# EAGLE board SP-PC-V3.0 (EAGLE 8.7.0), part 1 of 2
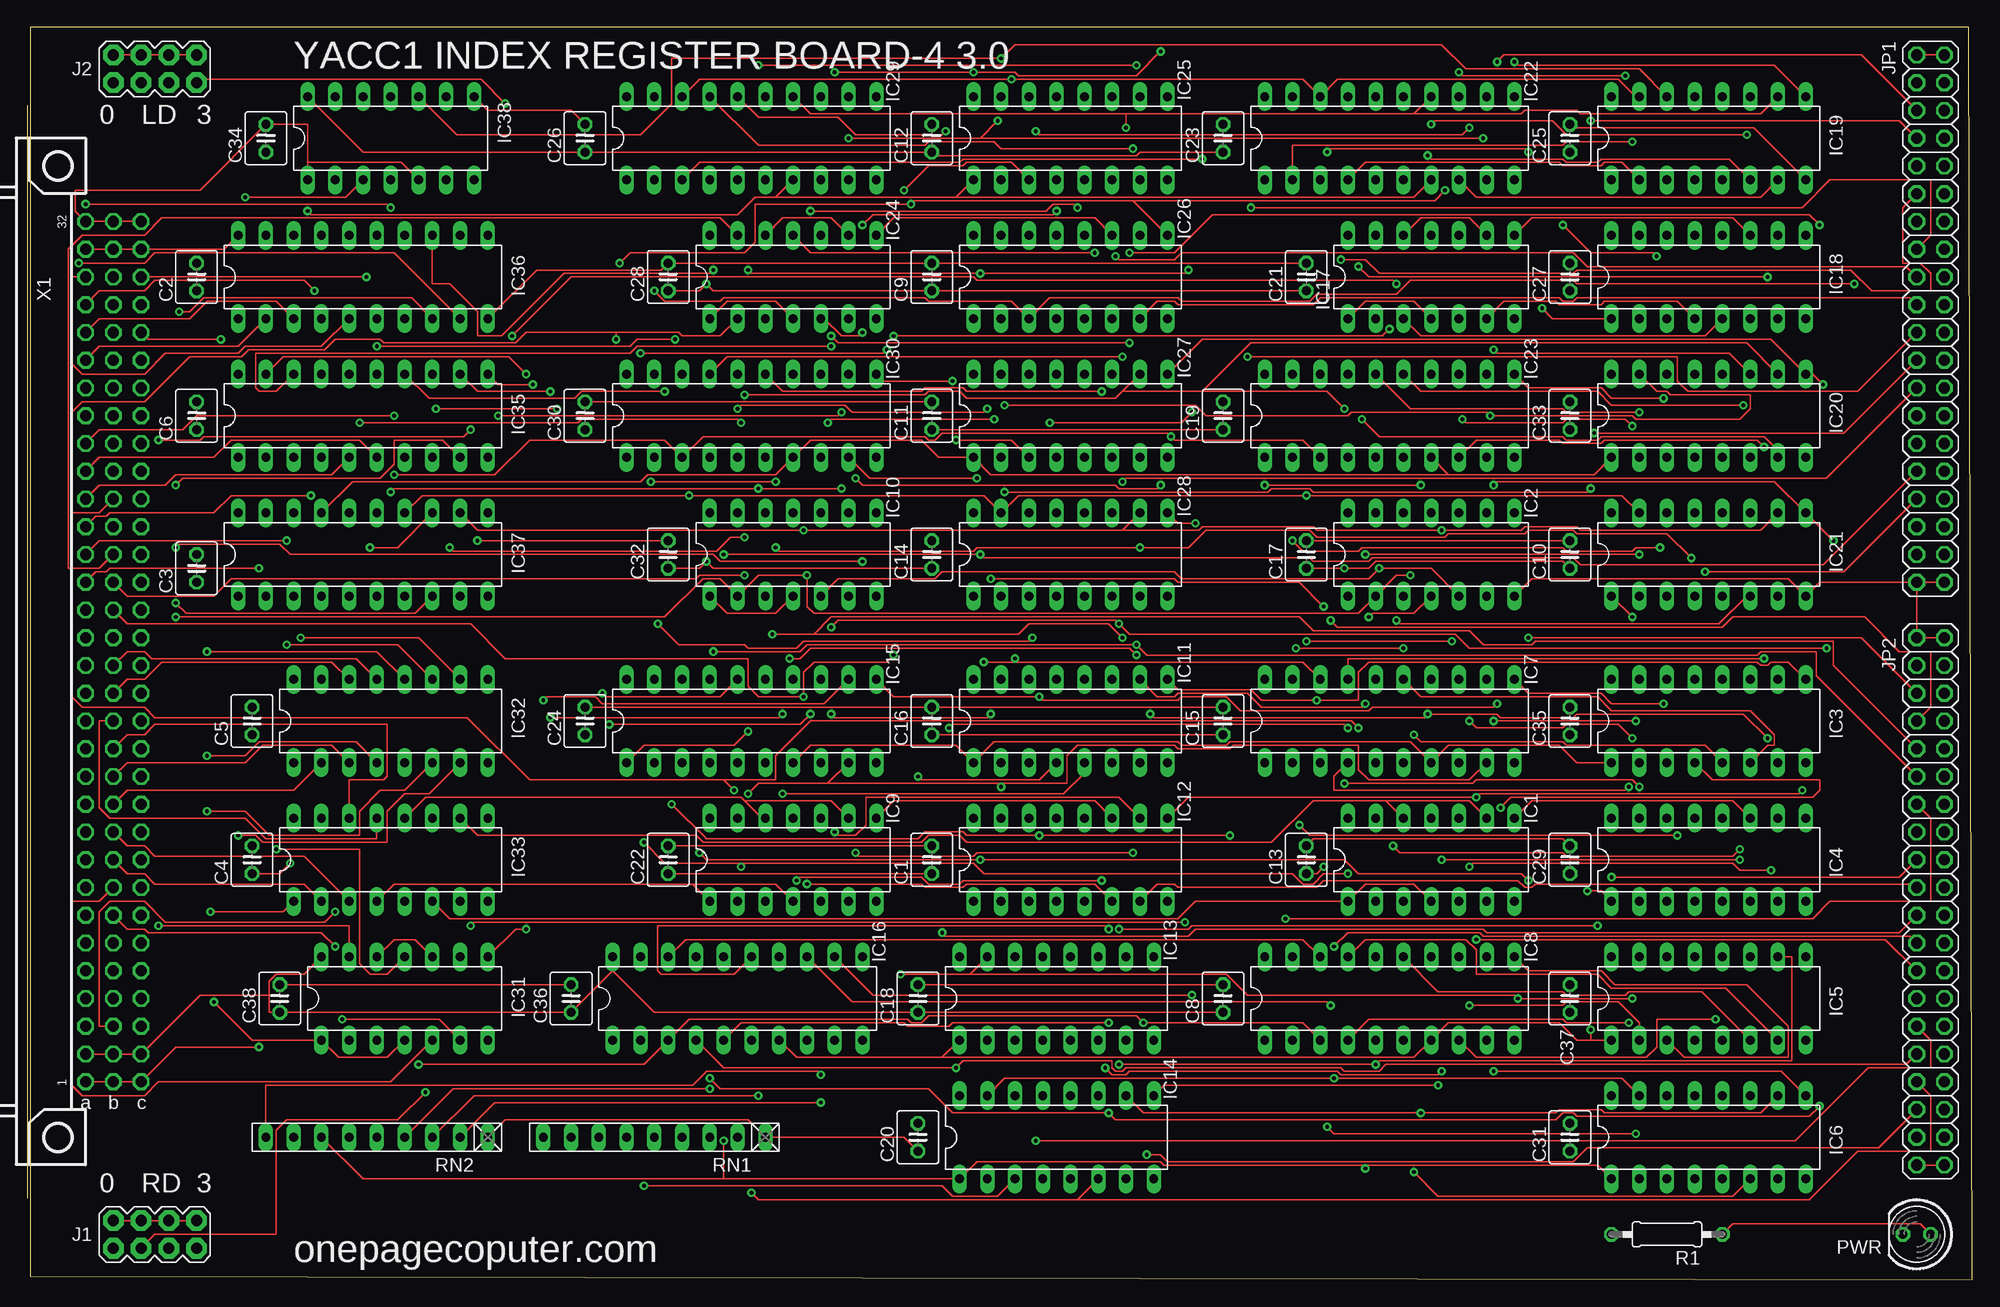
[diagram p9: board, top side]
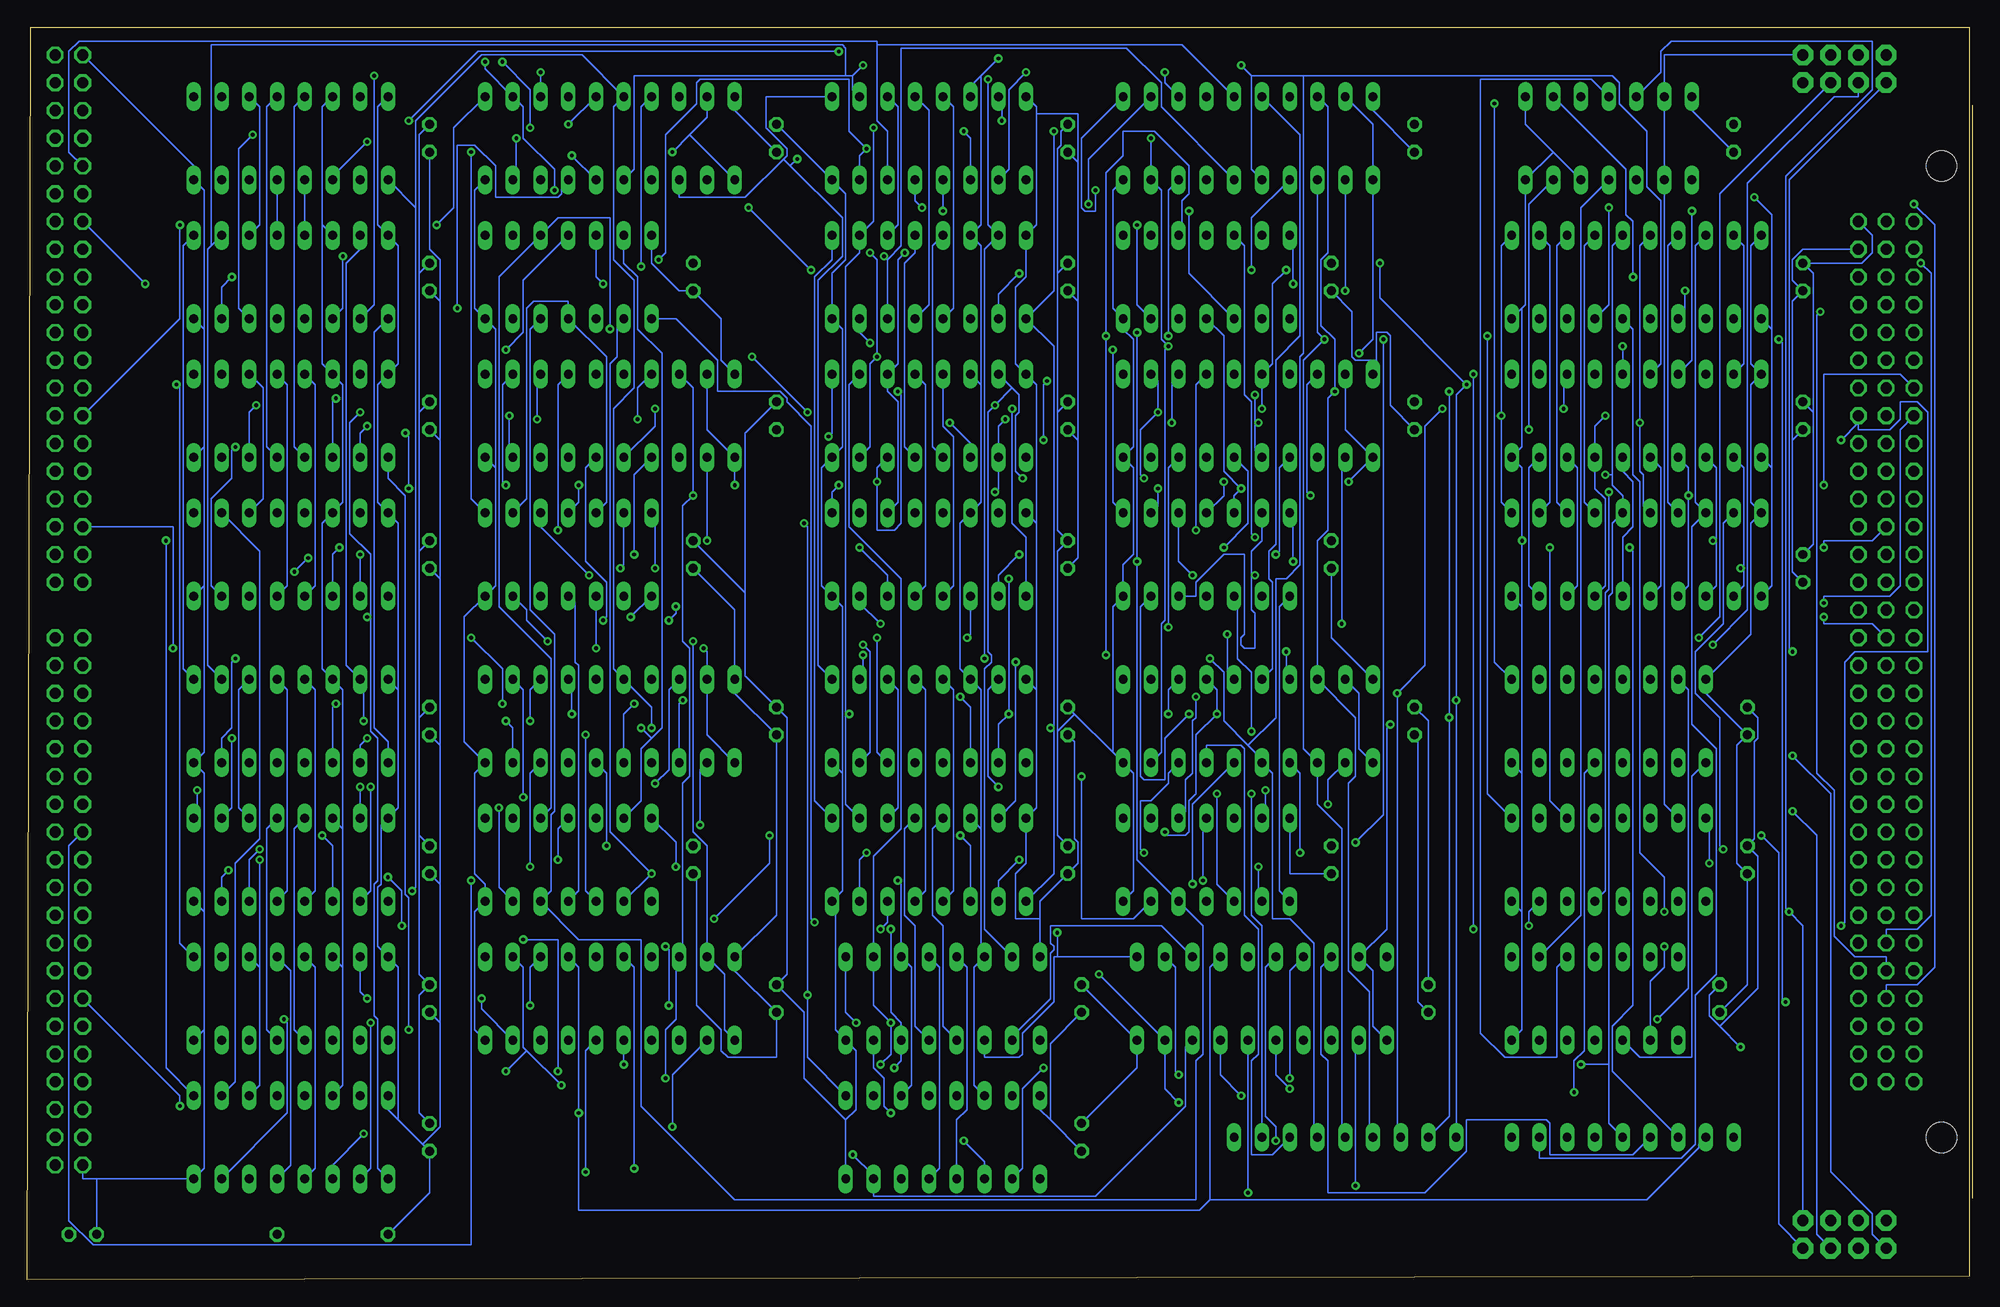
[diagram p10: board, bottom side, seen from below]

Size 177.8 x 114.62 mm. Coordinates in mm from the lower left corner, seen from the top.
Outline: 0,0.33 177.8,0 177.47,114.62 0,114.62 0,0.33
Copper layers (1*16): Top 0.035mm / dielectric 1.5mm / Bottom 0.035mm
Design rules "default": minimum track width 6mil, minimum drill 0.35mm, track to track 6mil, track to pad 6mil, pad to pad 6mil, via to via 6mil, smd to smd 6mil, copper to edge 40mil, drill to drill 6mil, minimum pad ring 10mil, minimum via ring 8mil, stop-mask expansion 4mil, vias tented up to drill 0mil, thermal gap 10mil

## Footprints (pad centres in the part's own frame; a part is rotated, then mirrored left to right if it is on the bottom)
C025-040X050 = drill 0.813 octagon: 1 -1.27,0; 2 1.27,0
DIL14 = drill 0.813 long: 1 -7.62,-3.81; 2 -5.08,-3.81; 3 -2.54,-3.81; 4 0,-3.81; 5 2.54,-3.81; 6 5.08,-3.81; 7 7.62,-3.81; 8 7.62,3.81; 9 5.08,3.81; 10 2.54,3.81; 11 0,3.81; 12 -2.54,3.81; 13 -5.08,3.81; 14 -7.62,3.81
DIL16 = drill 0.813 long: 1 -8.89,-3.81; 2 -6.35,-3.81; 3 -3.81,-3.81; 4 -1.27,-3.81; 5 1.27,-3.81; 6 3.81,-3.81; 7 6.35,-3.81; 8 8.89,-3.81; 9 8.89,3.81; 10 6.35,3.81; 11 3.81,3.81; 12 1.27,3.81; 13 -1.27,3.81; 14 -3.81,3.81; 15 -6.35,3.81; 16 -8.89,3.81
DIL20 = drill 0.813 long: 1 -11.43,-3.81; 2 -8.89,-3.81; 3 -6.35,-3.81; 4 -3.81,-3.81; 5 -1.27,-3.81; 6 1.27,-3.81; 7 3.81,-3.81; 8 6.35,-3.81; 9 8.89,-3.81; 10 11.43,-3.81; 11 11.43,3.81; 12 8.89,3.81; 13 6.35,3.81; 14 3.81,3.81; 15 1.27,3.81; 16 -1.27,3.81; 17 -3.81,3.81; 18 -6.35,3.81; 19 -8.89,3.81; 20 -11.43,3.81
2X4 = drill 1.016 pad 1.88 octagon: 1 -3.81,-1.27; 2 -3.81,1.27; 3 -1.27,-1.27; 4 -1.27,1.27; 5 1.27,-1.27; 6 1.27,1.27; 7 3.81,-1.27; 8 3.81,1.27
2X20 = drill 1.016 octagon: 1 -24.13,-1.27; 2 -24.13,1.27; 3 -21.59,-1.27; 4 -21.59,1.27; 5 -19.05,-1.27; 6 -19.05,1.27; 7 -16.51,-1.27; 8 -16.51,1.27; 9 -13.97,-1.27; 10 -13.97,1.27; 11 -11.43,-1.27; 12 -11.43,1.27; 13 -8.89,-1.27; 14 -8.89,1.27; 15 -6.35,-1.27; 16 -6.35,1.27; 17 -3.81,-1.27; 18 -3.81,1.27; 19 -1.27,-1.27; 20 -1.27,1.27; 21 1.27,-1.27; 22 1.27,1.27; 23 3.81,-1.27; 24 3.81,1.27; 25 6.35,-1.27; 26 6.35,1.27; 27 8.89,-1.27; 28 8.89,1.27; 29 11.43,-1.27; 30 11.43,1.27; 31 13.97,-1.27; 32 13.97,1.27; 33 16.51,-1.27; 34 16.51,1.27; 35 19.05,-1.27; 36 19.05,1.27; 37 21.59,-1.27; 38 21.59,1.27; 39 24.13,-1.27; 40 24.13,1.27
LED5MM = drill 0.813 octagon: A -1.27,0; K 1.27,0
0207/10 = drill 0.813 octagon: 1 -5.08,0; 2 5.08,0
RN-9 = drill 0.813 long: 1 -10.16,0; 2 -7.62,0; 3 -5.08,0; 4 -2.54,0; 5 0,0; 6 2.54,0; 7 5.08,0; 8 7.62,0; 9 10.16,0
FABC96R = drill 1.016 octagon: A1 -2.54,39.37; A2 -2.54,36.83; A3 -2.54,34.29; A4 -2.54,31.75; A5 -2.54,29.21; A6 -2.54,26.67; A7 -2.54,24.13; A8 -2.54,21.59; A9 -2.54,19.05; A10 -2.54,16.51; A11 -2.54,13.97; A12 -2.54,11.43; A13 -2.54,8.89; A14 -2.54,6.35; A15 -2.54,3.81; A16 -2.54,1.27; A17 -2.54,-1.27; A18 -2.54,-3.81; A19 -2.54,-6.35; A20 -2.54,-8.89; A21 -2.54,-11.43; A22 -2.54,-13.97; A23 -2.54,-16.51; A24 -2.54,-19.05; A25 -2.54,-21.59; A26 -2.54,-24.13; A27 -2.54,-26.67; A28 -2.54,-29.21; A29 -2.54,-31.75; A30 -2.54,-34.29; A31 -2.54,-36.83; A32 -2.54,-39.37; B1 -5.08,39.37; B2 -5.08,36.83; B3 -5.08,34.29; B4 -5.08,31.75; B5 -5.08,29.21; B6 -5.08,26.67; B7 -5.08,24.13; B8 -5.08,21.59; B9 -5.08,19.05; B10 -5.08,16.51; B11 -5.08,13.97; B12 -5.08,11.43; B13 -5.08,8.89; B14 -5.08,6.35; B15 -5.08,3.81; B16 -5.08,1.27; B17 -5.08,-1.27; B18 -5.08,-3.81; B19 -5.08,-6.35; B20 -5.08,-8.89; B21 -5.08,-11.43; B22 -5.08,-13.97; B23 -5.08,-16.51; B24 -5.08,-19.05; B25 -5.08,-21.59; B26 -5.08,-24.13; B27 -5.08,-26.67; B28 -5.08,-29.21; B29 -5.08,-31.75; B30 -5.08,-34.29; B31 -5.08,-36.83; B32 -5.08,-39.37; C1 -7.62,39.37; C2 -7.62,36.83; C3 -7.62,34.29; C4 -7.62,31.75; C5 -7.62,29.21; C6 -7.62,26.67; C7 -7.62,24.13; C8 -7.62,21.59; C9 -7.62,19.05; C10 -7.62,16.51; C11 -7.62,13.97; C12 -7.62,11.43; C13 -7.62,8.89; C14 -7.62,6.35; C15 -7.62,3.81; C16 -7.62,1.27; C17 -7.62,-1.27; C18 -7.62,-3.81; C19 -7.62,-6.35; C20 -7.62,-8.89; C21 -7.62,-11.43; C22 -7.62,-13.97; C23 -7.62,-16.51; C24 -7.62,-19.05; C25 -7.62,-21.59; C26 -7.62,-24.13; C27 -7.62,-26.67; C28 -7.62,-29.21; C29 -7.62,-31.75; C30 -7.62,-34.29; C31 -7.62,-36.83; C32 -7.62,-39.37 | hole 2.794: 0,-44.456; 0,44.456

## Placement (x,y rotation side)
C1  0.1  [C025-040X050]  82.55,38.43 90 top
C2  0.1  [C025-040X050]  15.24,91.77 90 top
C3  0.1  [C025-040X050]  15.24,65.1 90 top
C4  0.1  [C025-040X050]  20.32,38.43 90 top
C5  0.1  [C025-040X050]  20.32,51.13 90 top
C6  0.1  [C025-040X050]  15.24,79.07 90 top
C8  0.1  [C025-040X050]  109.22,25.73 90 top
C9  0.1  [C025-040X050]  82.55,91.77 90 top
C10  0.1  [C025-040X050]  140.97,66.37 90 top
C11  0.1  [C025-040X050]  82.55,79.07 90 top
C12  0.1  [C025-040X050]  82.55,104.47 90 top
C13  0.1  [C025-040X050]  116.84,38.43 90 top
C14  0.1  [C025-040X050]  82.55,66.37 90 top
C15  0.1  [C025-040X050]  109.22,51.13 90 top
C16  0.1  [C025-040X050]  82.55,51.13 90 top
C17  0.1  [C025-040X050]  116.84,66.37 90 top
C18  0.1  [C025-040X050]  81.28,25.73 90 top
C19  0.1  [C025-040X050]  109.22,79.07 90 top
C20  0.1  [C025-040X050]  81.28,13.03 90 top
C21  0.1  [C025-040X050]  116.84,91.77 90 top
C22  0.1  [C025-040X050]  58.42,38.43 90 top
C23  0.1  [C025-040X050]  109.22,104.47 90 top
C24  0.1  [C025-040X050]  50.8,51.13 90 top
C25  0.1  [C025-040X050]  140.97,104.47 90 top
C26  0.1  [C025-040X050]  50.8,104.47 90 top
C27  0.1  [C025-040X050]  140.97,91.77 90 top
C28  0.1  [C025-040X050]  58.42,91.77 90 top
C29  0.1  [C025-040X050]  140.97,38.43 90 top
C30  0.1  [C025-040X050]  50.8,79.07 90 top
C31  0.1  [C025-040X050]  140.97,13.03 90 top
C32  0.1  [C025-040X050]  58.42,66.37 90 top
C33  0.1  [C025-040X050]  140.97,79.07 90 top
C34  0.1  [C025-040X050]  21.59,104.47 90 top
C35  0.1  [C025-040X050]  140.97,51.13 90 top
C36  0.1  [C025-040X050]  49.53,25.73 90 top
C37  0.1  [C025-040X050]  140.97,25.73 90 top
C38  0.1  [C025-040X050]  22.86,25.73 90 top
IC1  74LS32N  [DIL14]  128.27,38.43 0 top
IC2  74LS32N  [DIL14]  128.27,66.37 0 top
IC3  74LS192N  [DIL16]  153.67,51.13 0 top
IC4  74LS192N  [DIL16]  153.67,38.43 0 top
IC5  74LS192N  [DIL16]  153.67,25.73 0 top
IC6  74LS192N  [DIL16]  153.67,13.03 0 top
IC7  74LS244N  [DIL20]  124.46,51.13 0 top
IC8  74LS244N  [DIL20]  124.46,25.73 0 top
IC9  74LS32N  [DIL14]  69.85,38.43 0 top
IC10  74LS32N  [DIL14]  69.85,66.37 0 top
IC11  74LS192N  [DIL16]  95.25,51.13 0 top
IC12  74LS192N  [DIL16]  95.25,38.43 0 top
IC13  74LS192N  [DIL16]  93.98,25.73 0 top
IC14  74LS192N  [DIL16]  93.98,13.03 0 top
IC15  74LS244N  [DIL20]  66.04,51.13 0 top
IC16  74LS244N  [DIL20]  64.77,25.73 0 top
IC17  74LS32N  [DIL14]  128.27,91.77 0 top
IC18  74LS192N  [DIL16]  153.67,91.77 0 top
IC19  74LS192N  [DIL16]  153.67,104.47 0 top
IC20  74LS192N  [DIL16]  153.67,79.07 0 top
IC21  74LS192N  [DIL16]  153.67,66.37 0 top
IC22  74LS244N  [DIL20]  124.46,104.47 0 top
IC23  74LS244N  [DIL20]  124.46,79.07 0 top
IC24  74LS32N  [DIL14]  69.85,91.77 0 top
IC25  74LS192N  [DIL16]  95.25,104.47 0 top
IC26  74LS192N  [DIL16]  95.25,91.77 0 top
IC27  74LS192N  [DIL16]  95.25,79.07 0 top
IC28  74LS192N  [DIL16]  95.25,66.37 0 top
IC29  74LS244N  [DIL20]  66.04,104.47 0 top
IC30  74LS244N  [DIL20]  66.04,79.07 0 top
IC31  74LS32N  [DIL14]  34.29,25.73 0 top
IC32  74LS139N  [DIL16]  33.02,51.13 0 top
IC33  74LS139N  [DIL16]  33.02,38.43 0 top
IC35  74LS245N  [DIL20]  30.48,79.07 0 top
IC36  74LS245N  [DIL20]  30.48,91.77 0 top
IC37  74LS245N  [DIL20]  30.48,66.37 0 top
IC38  74LS266N  [DIL14]  33.02,104.47 0 top
J1  [2X4]  11.43,4.14 0 top
J2  [2X4]  11.43,110.82 0 top
JP1  [2X20]  173.99,87.96 270 top
JP2  [2X20]  173.99,34.62 270 top
PWR  [LED5MM]  172.72,4.14 180 top
R1  330  [0207/10]  149.86,4.14 180 top
RN1  10k  [RN-9]  57.15,13.03 180 top
RN2  10k  [RN-9]  31.75,13.03 180 top
X1  FABC96R  [FABC96R]  2.54,57.48 180 top

## Tracks (layer width: path | path; a pad name or v marks a point on that pad's centre or on a via)
-BUS-EN  (via drill 0.35)
  Top 0.152: IC31.4 32.7,20.33 28.26,20.33 IC31.1 20.32,21.92 v16.83,25.41 | X1.C28 10.79,86.05 v17.46,86.05
  Bottom 0.152: v17.46,86.05 17.14,85.74 17.14,25.73 v16.83,25.41
-HL-SWAP  (via drill 0.35)
  Top 0.152: IC31.13 29.21,32.4 v11.75,32.4 | v40.32,77.8 39.69,77.16 15.88,77.16 15.56,76.85 v11.75,76.85
  Bottom 0.152: v11.75,32.4 11.43,32.71 11.43,56.53 10.48,57.48 3.81,57.48 3.81,79.39 4.76,80.34 6.35,80.34 6.35,78.75 7.3,77.8 10.16,77.8 10.16,78.44 | IC38.6 40.32,98.44 v40.32,77.8 | 10.16,78.44 v11.75,76.85 | 10.16,78.44 X1.C25
-LDSEL
  Top 0.152: J2.2 J2.4 J2.6 J2.8
  Bottom 0.152: IC33.15 27.94,43.51 IC38.2 IC38.13 27.94,112.09 J2.8
-R0-LDSEL
  Top 0.152: IC33.12 36.2,44.14 65.09,44.14 65.41,43.83 | 65.41,43.83 66.99,42.24 IC9.12 | IC9.9 73.34,43.83 65.41,43.83
-R0-RDSEL
  Top 0.152: IC10.1 63.82,60.97 68.26,60.97 IC10.4 | IC33.4 33.34,36.21 60.64,36.21 | IC9.1 60.64,36.21 | IC9.4 68.26,36.21 60.64,36.21
  Bottom 0.152: IC10.1 63.18,61.61 63.18,35.57 IC9.1
-R1-LDSEL  (via drill 0.35)
  Top 0.152: v38.42,67 38.73,66.69 62.87,66.69 64.14,67.96 v65.41,67.96 | IC24.9 73.34,97.17 68.9,97.17 IC24.12
  Bottom 0.152: IC33.11 38.42,43.83 v38.42,67 | v65.41,67.96 65.72,68.27 65.72,80.34 66.36,80.97 66.36,94.63 IC24.12
-R1-RDSEL  (via drill 0.35)
  Top 0.152: IC24.1 63.82,89.55 68.26,89.55 IC24.4 | v33.02,72.08 33.34,72.4 v66.67,72.4 v74.3,72.4
  Bottom 0.152: IC33.5 33.34,35.57 33.34,62.88 33.02,63.2 v33.02,72.08 | IC10.12 67.31,71.77 v66.67,72.4 68.26,73.99 68.26,86.37 IC24.4 | IC10.9 74.3,70.81 v74.3,72.4
-R2-LDSEL
  Top 0.152: IC33.10 40.96,40.65 60.96,40.65 61.59,40.02 81.6,40.02 82.23,40.65 85.09,40.65 85.72,40.02 113.67,40.02 117.47,43.83 124.14,43.83 | IC1.12 124.14,43.83 | IC1.9 131.76,43.83 124.14,43.83
-R2-RDSEL  (via drill 0.35)
  Top 0.152: v122.56,60.66 122.87,60.97 126.68,60.97 IC2.4 | IC33.6 38.42,33.03 105.09,33.03 106.68,34.62 IC1.1 122.24,36.21 126.68,36.21 IC1.4
  Bottom 0.152: v122.56,60.66 IC2.1 | IC2.4 127.64,61.92 127.64,56.53 127.32,56.21 127.32,35.57 IC1.4
-R3-LDSEL  (via drill 0.35)
  Top 0.152: v44.13,86.37 49.53,91.77 86.36,91.77 86.68,91.45 124.78,91.45 v125.09,91.14 | IC17.9 131.76,97.17 127.32,97.17 IC17.12
  Bottom 0.152: IC33.9 44.13,44.46 v44.13,86.37 | v125.09,91.14 125.73,91.77 IC17.12
-R3-RDSEL  (via drill 0.35)
  Top 0.152: v40.32,32.4 40.64,32.71 v105.73,32.71 | IC17.4 126.68,89.55 122.24,89.55 IC17.1
  Bottom 0.152: IC2.12 124.78,71.13 124.78,84.47 IC17.4 128.27,89.55 131.44,89.55 132.08,88.91 132.08,71.45 IC2.9 | IC33.7 40.32,33.67 v40.32,32.4 | v105.73,32.71 106.05,33.03 106.05,78.12 108.27,80.34 108.27,80.66 108.9,81.29 114.62,81.29 114.62,84.15 118.43,87.96 IC17.1
-RDSEL  (via drill 0.35)
  Top 0.152: J1.2 J1.4 J1.6 J1.8 | IC33.1 23.18,33.67 v16.51,33.67
  Bottom 0.152: J1.8 15.24,32.4 v16.51,33.67 16.83,33.98 16.83,100.98 8.89,108.91 8.89,113.36 27.3,113.36 28.26,112.41 28.26,110.5 IC38.12
-REG-DN  (via drill 0.35)
  Top 0.152: v76.2,86.69 75.88,86.37 74.3,86.37 72.71,87.96 IC24.5 | v13.34,67 13.65,67.32 22.86,67.32 23.81,66.37 62.55,66.37 63.18,65.73 v76.2,65.73
  Bottom 0.152: IC17.5 131.76,87.01 131.76,61.29 129.54,59.07 129.54,42.88 129.86,42.56 129.86,35.57 IC1.5 127.32,31.13 121.6,31.13 121.6,15.89 113.03,7.32 70.8,7.32 70.8,20.01 70.17,20.65 70.17,32.4 IC9.5 76.2,38.43 v76.2,65.73 v76.2,86.69 | X1.B21 8.89,67.64 13.34,67.64 v13.34,67
-REG-FUNC-LD
  Top 0.152: IC31.5 33.02,18.11 11.75,18.11 10.48,16.84 4.76,16.84 3.81,17.79 3.81,34.62 6.35,34.62 X1.B8
-REG-FUNC-RD  (via drill 0.35)
  Top 0.152: v27.94,30.49 26.67,31.76 10.79,31.76 10.48,32.08 8.89,32.08 X1.B7
  Bottom 0.152: IC31.2 29.21,27.32 27.94,28.59 v27.94,30.49
-REG-LD-HI  (via drill 0.35)
  Top 0.152: 63.5,45.73 v64.45,44.78 | 63.5,45.73 45.72,45.73 40.01,51.45 11.43,51.45 10.48,52.4 4.76,52.4 3.81,53.35 3.81,65.1 | 3.81,65.1 6.35,65.1 X1.B20 | IC24.13 63.18,97.17 12.06,97.17 10.48,95.58 4.76,95.58 3.49,94.31 3.49,65.1 3.81,65.1 | v121.6,50.49 120.97,51.13 71.44,51.13 68.26,47.95 68.26,45.73 63.5,45.73
  Bottom 0.152: IC1.13 121.6,43.83 121.6,48.59 120.65,49.54 | 120.65,49.54 119.7,50.49 119.7,84.78 121.92,87.01 121.92,91.77 123.19,93.04 IC17.13 | IC9.13 64.45,42.56 v64.45,44.78 | v121.6,50.49 120.65,49.54
-REG-LD-LO  (via drill 0.35)
  Top 0.152: X1.B18 8.89,60.02 40.32,60.02 43.5,56.84 65.72,56.84 65.72,54.3 66.67,53.35 v70.8,53.35 70.8,55.57 71.75,56.53 78.42,56.53 v79.06,57.16 | v124.46,87.01 123.83,86.37 v79.06,86.37
  Bottom 0.152: IC1.10 129.86,43.19 129.86,56.84 134.62,61.61 134.62,91.77 IC17.10 129.22,97.17 124.46,97.17 v124.46,87.01 | IC9.10 71.75,42.88 71.75,45.73 71.12,46.37 71.12,51.13 70.8,51.45 v70.8,53.35 | IC24.10 72.07,95.9 72.07,98.75 71.44,99.39 71.44,101.93 74.61,105.11 77.47,105.11 77.47,102.88 79.06,101.3 v79.06,86.37 v79.06,57.16
-REG-RD-HI  (via drill 0.35)
  Top 0.152: IC2.5 128.27,65.1 v123.51,65.1 122.56,64.15 105.41,64.15 104.78,64.78 83.5,64.78 82.87,64.15 73.98,64.15 IC10.5 | X1.B19 8.89,62.56 16.83,62.56 18.41,64.15 60.96,64.15 61.28,64.47 v65.41,64.47
  Bottom 0.152: v123.51,65.1 123.19,65.42 IC2.13 | IC10.5 70.8,62.56 70.8,63.83 68.26,66.37 66.36,66.37 66.36,59.07 66.67,58.75 66.67,58.11 66.36,57.8 65.41,57.8 65.41,60.97 65.72,61.29 65.72,64.47 | 65.72,64.47 65.72,66.69 64.77,67.64 IC10.13 | 65.72,64.47 v65.41,64.47
-REG-RD-LO  (via drill 0.35)
  Top 0.152: v126.36,64.47 125.09,64.47 IC2.2 121.6,60.97 71.75,60.97 71.12,61.61 v71.12,64.47 66.67,64.47 IC10.2 63.18,64.15 61.59,64.15 58.1,60.66 v13.34,60.66
  Bottom 0.152: v126.36,64.47 130.81,68.91 IC2.10 | v71.12,64.47 72.39,65.73 IC10.10 | X1.B17 8.89,60.02 13.34,60.02 v13.34,60.66
-REG-UP  (via drill 0.35)
  Top 0.152: IC24.2 63.18,86.37 59.69,86.37 59.37,86.69 53.66,86.69 | 53.66,86.69 45.4,86.69 44.45,85.74 32.38,85.74 32.07,86.05 27.94,86.05 26.99,85.1 20,85.1 19.37,84.47 14.61,84.47 10.48,80.34 4.76,80.34 3.81,79.39 3.81,70.18 6.35,70.18 X1.B22 | 65.41,38.11 v65.09,37.8 | 65.41,38.11 86.36,38.11 87.31,37.16 115.57,37.16 116.52,36.21 117.47,36.21 118.43,37.16 v120.65,37.16 | v53.66,86.05 53.66,86.69 | v56.2,40.02 58.1,38.11 65.41,38.11
  Bottom 0.152: IC9.2 65.09,34.94 v65.09,37.8 | IC1.2 v120.65,37.16 124.46,40.97 124.46,83.83 123.83,84.47 123.83,87.33 IC17.2 | v53.66,86.05 53.66,42.56 v56.2,40.02
-RESET  (via drill 0.35)
  Top 0.152: X1.C30 v30.8,91.77
  Bottom 0.152: IC38.9 31.43,101.61 31.43,97.48 30.8,96.85 v30.8,91.77
-RLD0  (via drill 0.35)
  Top 0.152: IC32.12 31.75,57.48 v16.19,57.48
  Bottom 0.152: v16.19,57.48 16.51,57.8 16.51,100.66 J2.1
-RRD0  (via drill 0.35)
  Top 0.152: IC32.4 29.84,49.23 20.95,49.23 19.68,47.95 v16.19,47.95
  Bottom 0.152: v16.19,47.95 12.7,44.46 12.7,9.86 8.89,6.04 8.89,4.14 J1.1
ADATA0  (via drill 0.35)
  Top 0.152: IC35.18 22.54,81.29 20.95,81.29 20.64,81.61 20.64,84.78 54.93,84.78 55.56,85.42 v73.34,85.42 | 87,104.47 v88.58,106.06 | v74.93,104.47 87,104.47 | 87,104.47 v133.03,104.47 | v65.72,44.46 66.67,45.41 73.03,45.41 | IC15.9 73.03,45.41 | 88.58,45.41 v88.9,45.1 | 73.03,45.41 88.58,45.41 | IC7.9 131.76,45.73 122.56,45.73 121.6,46.68 121.6,48.91 110.17,48.91 109.86,48.59 105.09,48.59 104.78,48.91 95.89,48.91 94.93,47.95 94.93,45.41 88.58,45.41 | v133.99,51.13 v147,51.13
  Bottom 0.152: IC25.15 88.58,107.96 v88.58,106.06 | v74.93,104.47 IC29.9 73.98,99.71 73.98,86.05 v73.34,85.42 73.66,85.1 73.66,60.34 73.98,60.02 73.98,48.27 IC15.9 | IC22.9 133.03,100.98 v133.03,104.47 | IC18.15 147.32,94.31 148.59,93.04 148.59,56.21 IC3.15 147,54.62 v147,51.13 | RN1.2 64.77,32.4 65.72,33.35 v65.72,44.46 | IC11.15 89.85,53.99 89.85,46.05 v88.9,45.1 | v133.99,51.13 133.35,50.49 IC7.9
ADATA1  (via drill 0.35)
  Top 0.152: v25.4,97.8 25.72,97.48 64.77,97.48 66.36,99.07 68.26,99.07 | IC29.7 68.26,99.07 | 84.77,99.07 IC25.1 | 68.26,99.07 84.77,99.07 | IC22.7 126.68,99.07 84.77,99.07 | IC3.1 141.6,47.32 140.02,48.91 129.86,48.91 IC7.7 126.36,49.23 109.86,49.23 109.54,48.91 105.41,48.91 105.09,49.23 88.27,49.23 IC11.1 84.77,48.91 71.44,48.91 IC15.7 | v138.43,88.91 139.38,87.96 IC18.1
  Bottom 0.152: IC35.17 25.4,84.15 v25.4,97.8 | IC18.1 146.05,86.69 146.05,50.49 144.78,49.23 IC3.1 | RN1.3 63.82,11.44 65.72,11.44 65.72,20.01 65.09,20.65 65.09,32.08 66.36,33.35 66.36,48.59 66.67,48.91 69.85,48.91 IC15.7 | IC22.7 128.91,100.02 128.91,99.39 129.22,99.07 134.94,99.07 134.94,101.93 136.84,103.83 138.43,103.83 v138.43,88.91
ADATA2  (via drill 0.35)
  Top 0.152: IC11.10 103.19,53.35 104.78,53.35 105.09,53.67 111.44,53.67 112.71,52.4 121.92,52.4 v122.24,52.72 | v101.28,57.16 100.65,57.8 71.44,57.8 70.48,56.84 v69.53,56.84 | v66.67,111.14 v101.28,111.14
  Bottom 0.152: IC25.10 102.23,108.91 102.23,110.19 | 102.87,110.19 122.24,110.19 122.24,101.61 IC22.5 | 102.87,110.19 102.23,110.19 | IC3.10 161.29,56.21 161.29,94.31 160.97,94.63 | IC18.10 160.97,94.63 | 102.87,110.19 102.87,112.72 103.19,113.04 160.97,113.04 160.97,94.63 | IC35.16 28.26,83.83 28.26,98.75 29.53,100.02 29.53,105.11 32.07,107.64 32.07,109.55 32.7,110.19 60.96,110.19 | 65.72,110.19 60.96,110.19 | 65.72,110.19 65.72,101.61 IC29.5 | v122.24,52.72 123.19,51.77 IC7.5 | RN1.4 60.01,13.35 60.01,30.81 62.23,33.03 63.82,33.03 63.82,46.37 IC15.5 64.77,47.64 66.04,48.91 | IC11.10 101.28,55.26 v101.28,57.16 | v69.53,56.84 68.26,55.57 68.26,51.13 66.04,48.91 | 60.96,110.19 60.96,84.78 61.28,84.47 61.28,65.42 62.55,64.15 63.5,64.15 63.5,51.45 66.04,48.91 | v101.28,111.14 102.23,110.19 | 65.72,110.19 v66.67,111.14
ADATA3  (via drill 0.35)
  Top 0.152: v31.75,85.42 54.93,85.42 55.56,86.05 v59.05,86.05 | IC11.9 105.09,53.99 111.76,53.99 112.71,53.03 v117.79,53.03 121.6,53.03 121.6,55.57 122.56,56.53 158.12,56.53 158.43,56.21 159.07,56.21 159.38,56.53 160.97,56.53 IC3.9 | IC29.3 61.28,102.25 85.09,102.25 85.41,102.56 v107.31,102.56
  Bottom 0.152: RN1.5 57.47,13.35 57.47,41.29 59.69,43.51 IC15.3 60.96,48.59 60.96,84.15 v59.05,86.05 59.69,86.69 IC29.3 | v31.75,85.42 IC35.15 | IC3.9 163.51,55.89 163.51,94.63 IC18.9 | v117.79,53.03 118.11,52.72 IC7.3 | IC25.9 110.17,108.28 110.17,105.42 108.27,103.52 108.27,102.88 108.58,102.56 | 108.58,102.56 112.08,99.07 118.11,99.07 IC22.3 | IC11.9 105.41,56.21 105.41,91.45 103.19,93.67 103.19,97.17 107.95,101.93 | 108.58,102.56 107.95,101.93 | 107.95,101.93 v107.31,102.56
ADATA4  (via drill 0.35)
  Top 0.152: 90.17,56.53 116.52,56.53 IC7.18 | 90.17,56.53 v87.31,56.53 | 90.17,56.53 v90.17,56.84 | v147.32,45.1 146.69,45.73 132.4,45.73 132.08,45.41 v120.33,45.41 | IC19.15 147,108.28 145.41,109.87 119.7,109.87 IC22.18 116.52,109.87 v89.85,109.87 61.28,109.87 IC29.18 | IC35.14 36.51,80.66 49.85,80.66 50.48,81.29 v58.1,81.29
  Bottom 0.152: IC12.15 87.31,43.83 v87.31,56.53 | v90.17,56.84 90.17,94.31 IC26.15 89.85,96.53 v89.85,109.87 | v147.32,45.1 IC4.15 | v120.33,45.41 119.06,46.68 119.06,53.99 IC7.18 | RN1.6 54.93,13.35 54.93,26.36 56.83,28.27 56.83,45.41 56.2,46.05 56.2,51.45 IC15.18 59.69,67.64 58.74,68.59 58.74,80.66 v58.1,81.29 58.1,86.05 59.37,87.33 59.37,93.36 58.74,93.99 58.74,107.33 IC29.18
ADATA5  (via drill 0.35)
  Top 0.152: IC4.1 143.83,35.57 v142.56,35.57 | v52.39,53.67 52.7,53.35 63.18,53.35 IC15.16 | v48.26,79.7 v37.15,79.7 | v83.82,105.11 83.5,104.79 75.56,104.79 73.98,106.38 66.67,106.38 IC29.16 | v120.65,50.49 120.33,50.81 84.45,50.81 v84.14,50.49
  Bottom 0.152: v142.56,35.57 142.24,35.89 142.24,98.12 | IC19.1 142.24,98.12 | 142.24,98.12 142.24,106.06 136.21,112.09 127,112.09 IC22.16 124.14,107.33 124.14,93.36 122.24,91.45 122.24,81.61 124.14,79.7 124.14,55.89 IC7.16 120.65,52.4 v120.65,50.49 | IC12.1 83.82,37.16 83.82,50.49 | 83.82,50.49 83.82,85.42 IC26.1 83.82,90.5 v83.82,105.11 | RN1.7 52.39,13.35 v52.39,53.67 49.85,56.21 49.85,78.12 v48.26,79.7 | IC35.13 37.15,82.56 v37.15,79.7 | IC29.16 61.28,104.79 61.28,86.37 63.5,84.15 63.5,67.32 64.14,66.69 64.14,64.15 63.82,63.83 63.82,55.89 IC15.16 | 83.82,50.49 v84.14,50.49
ADATA6  (via drill 0.35)
  Top 0.152: v47.62,81.29 40.96,81.29 IC35.12 | v68.9,51.77 68.58,51.45 v47.62,51.45 | IC29.14 71.44,106.69 100.33,106.69 | 126.68,106.69 100.33,106.69 | IC22.14 126.68,106.69 | IC19.10 158.43,106.69 141.92,106.69 141.6,107.01 136.84,107.01 136.53,106.69 126.68,106.69 | v102.55,51.77 102.87,51.45 127.64,51.45 v127.95,51.77 134.3,51.77 134.62,51.45 141.29,51.45 141.6,51.77 156.84,51.77 v159.07,49.54 | v100.33,105.42 100.33,106.69 | v73.66,40.97 73.98,40.65 75.56,40.65 76.52,41.6 76.52,44.14 99.69,44.14 IC12.10
  Bottom 0.152: RN1.8 47.62,14.94 v47.62,51.45 v47.62,81.29 | IC15.14 68.9,53.99 v68.9,51.77 70.8,49.86 70.8,44.46 71.44,43.83 71.44,40.97 71.75,40.65 73.66,40.65 v73.66,40.97 | IC12.10 102.87,43.51 102.87,51.77 | 102.87,51.77 102.87,92.72 101.6,93.99 IC26.10 100.33,96.85 v100.33,105.42 | IC7.14 127.95,54.62 v127.95,51.77 | 102.87,51.77 v102.55,51.77 | IC4.10 159.07,43.19 v159.07,49.54
ADATA7  (via drill 0.35)
  Top 0.152: v46.99,53.03 47.31,53.35 51.75,53.35 52.39,52.72 72.71,52.72 IC15.12 | IC35.11 42.86,81.93 v46.04,81.93 | v135.89,111.45 136.21,111.14 159.7,111.14 IC19.9 | IC12.9 106.05,44.14 v132.4,44.14 132.72,44.46 161.93,44.46 v162.24,44.78 | 100.97,98.75 80.96,98.75 v80.64,98.44 66.36,98.44 66.36,94.94 65.41,93.99 54.93,93.99 v53.98,93.04 | IC26.9 100.97,98.75 | v129.54,99.71 128.59,98.75 100.97,98.75
  Bottom 0.152: RN1.9 v46.99,53.03 46.99,80.97 v46.04,81.93 53.98,89.86 v53.98,93.04 | v135.89,111.45 135.89,110.82 IC22.12 132.4,107.33 132.4,104.47 129.54,101.61 v129.54,99.71 | IC12.9 105.73,43.83 105.73,91.77 104.14,93.36 IC26.9 | IC7.12 132.4,53.99 v132.4,44.14 | IC4.9 162.24,42.56 v162.24,44.78 | IC29.12 80.64,102.56 v80.64,98.44
ADATA8  (via drill 0.35)
  Top 0.152: IC20.15 148.91,81.29 149.86,81.29 150.18,80.97 157.48,80.97 157.48,79.7 156.53,78.75 147,78.75 146.69,79.07 v133.67,79.07 133.35,79.39 120.97,79.39 120.65,79.07 107.63,79.07 106.68,80.02 v89.22,80.02 | IC30.9 76.83,73.36 v86.68,73.36 | v146.69,25.73 v136.21,25.73 135.89,26.05 111.44,26.05 109.54,27.95 86.04,27.95 | RN2.2 42.55,16.2 v72.39,16.2 | 86.04,27.95 IC13.15 | v79.69,27.95 86.04,27.95
  Bottom 0.152: IC23.9 133.67,75.58 v133.67,79.07 | IC36.18 25.08,94.63 25.08,71.13 IC37.18 25.4,68.91 25.4,50.81 23.18,48.59 23.18,27.95 25.08,26.05 25.08,12.39 26.35,11.12 39.37,11.12 RN2.2 | v86.68,73.36 87.31,73.99 87.31,79.07 87,79.39 87,80.97 87.63,81.61 | IC27.15 87.63,81.61 | IC8.9 136.21,24.78 v136.21,25.73 | v146.69,25.73 147.32,26.36 IC5.15 | v72.39,16.2 73.66,17.47 IC16.9 v79.69,27.95 | 87.63,81.61 v89.22,80.02 89.85,79.39 89.85,57.48 89.53,57.16 89.53,56.53 90.17,55.89 90.17,32.08 IC13.15
ADATA9  (via drill 0.35)
  Top 0.152: IC5.1 142.88,21.92 | 142.88,21.92 141.6,21.92 140.02,23.51 129.86,23.51 IC8.7 126.68,20.33 83.5,20.33 | RN2.3 40.64,16.84 v66.67,16.84 | 83.5,20.33 IC13.1 | 83.5,20.33 70.17,20.33 IC16.7 | 129.86,73.67 IC23.7 | 129.86,73.67 143.19,73.67 IC20.1 | 129.86,73.67 87.95,73.67 IC27.1 83.19,75.26 81.6,76.85 71.44,76.85 IC30.7 68.26,73.67 56.52,73.67 55.88,73.04 29.53,73.04 IC37.17 | v142.88,22.87 142.88,21.92
  Bottom 0.152: v66.67,16.84 68.58,18.74 IC16.7 | IC37.17 27.62,71.13 27.62,94.63 IC36.17 | v142.88,22.87 142.88,34.94 143.19,35.25 143.19,71.77 144.78,73.36 IC20.1
ADATA10  (via drill 0.35)
  Top 0.152: IC5.10 161.29,29.54 161.29,20.01 123.51,20.01 v123.19,19.7 v99.69,19.7 | RN2.4 38.73,17.47 v62.23,17.47 | v65.41,80.97 81.92,80.97 82.23,81.29 85.09,81.29 85.72,80.66 99.38,80.66 100.01,81.29 | IC27.10 100.01,81.29 | v120.33,79.7 118.75,81.29 107.31,81.29 | 100.01,81.29 107.31,81.29 | IC20.10 157.16,85.74 111.76,85.74 107.31,81.29 | v30.16,78.44 50.16,78.44 50.48,78.75 64.77,78.75 v65.09,78.44 | IC16.5 65.09,23.51 80.01,23.51 80.33,23.19 84.14,23.19 84.45,23.51 v98.74,23.51
  Bottom 0.152: v123.19,19.7 IC8.5 | v62.23,17.47 63.5,18.74 IC16.5 | IC37.16 29.84,70.81 29.84,73.67 30.16,73.99 v30.16,78.44 30.16,94.63 IC36.16 | IC30.5 65.41,75.89 65.41,78.44 | v65.41,80.97 65.41,78.44 | IC27.10 102.55,81.93 102.55,68.91 97.79,64.15 97.79,41.29 100.33,38.75 IC13.10 100.33,25.09 v98.74,23.51 98.74,20.65 v99.69,19.7 | IC23.5 120.33,78.12 v120.33,79.7 | 65.41,78.44 v65.09,78.44
ADATA11  (via drill 0.35)
  Top 0.152: v164.15,81.93 163.19,82.88 IC20.9 159.38,86.05 107.31,86.05 IC27.9 | IC8.3 116.52,23.51 v101.92,23.51 101.28,24.14 82.23,24.14 81.6,23.51 80.64,23.51 80.33,23.82 60.33,23.82 IC16.3 56.2,19.7 v35.56,19.7 | IC23.3 116.52,76.85 104.78,76.85 v104.46,77.16 104.14,77.48 83.5,77.48 82.87,76.85 82.23,76.85 81.92,77.16 61.59,77.16 IC30.3 58.1,76.85 45.72,76.85 42.55,73.67 v33.34,73.67
  Bottom 0.152: IC5.9 163.83,30.81 163.83,81.61 v164.15,81.93 | v101.92,23.51 102.87,24.46 IC13.9 | v104.46,77.16 104.14,77.48 IC27.9 | RN2.5 33.02,14.3 33.02,19.7 | 33.02,19.7 33.02,62.56 32.7,62.88 32.7,69.23 IC37.15 31.75,71.77 32.7,72.72 32.7,73.67 | 33.02,19.7 v35.56,19.7 | IC36.15 32.7,94.63 32.7,73.67 | 32.7,73.67 v33.34,73.67
ADATA12  (via drill 0.35)
  Top 0.152: IC14.15 89.22,18.43 v119.38,18.43 145.73,18.43 IC6.15 | IC16.18 60.01,31.13 116.52,31.13 IC8.18 | IC37.14 35.88,71.77 v60.33,71.77 87.31,71.77 IC28.15 90.49,71.77 v116.84,71.77 145.73,71.77 IC21.15
  Bottom 0.152: RN2.6 30.8,11.44 38.42,11.44 38.42,14.3 38.73,14.62 46.04,14.62 46.04,11.76 49.85,7.95 58.74,7.95 58.74,20.01 59.37,20.65 59.37,28.59 IC16.18 | v119.38,18.43 119.38,22.87 118.43,23.82 118.43,29.22 IC8.18 117.79,29.86 117.79,45.41 117.16,46.05 117.16,57.8 117.79,58.43 117.79,70.81 v116.84,71.77 116.84,81.61 IC23.18 | IC37.14 35.24,71.13 35.24,94.63 IC36.14 | IC30.18 60.64,81.93 60.64,72.08 v60.33,71.77
ADATA13  (via drill 0.35)
  Top 0.152: v87.63,79.7 87.31,79.39 75.25,79.39 74.61,80.02 65.09,80.02 v64.77,79.7 | IC36.13 36.83,91.14 38.42,91.14 40.96,88.59 40.96,86.37 43.18,86.37 48.9,92.09 62.23,92.09 v62.55,92.41 | RN2.7 30.48,9.22 63.5,9.22 | 63.5,9.22 IC14.1 86.68,10.81 103.5,10.81 103.82,10.49 122.24,10.49 | 63.5,9.22 v63.5,12.71 | IC6.1 143.51,10.49 122.24,10.49 | 122.24,10.49 v122.24,10.17 | v146.69,60.66 IC21.1 | IC23.16 126.36,79.7 140.34,79.7 140.65,79.39 v147.32,79.39 | IC37.13 33.66,67 v31.11,67
  Bottom 0.152: IC37.13 37.78,71.13 37.78,94.63 IC36.13 | IC28.1 86.36,67.96 87.63,69.23 v87.63,79.7 | v64.77,79.7 IC30.16 63.82,83.83 63.82,91.14 v62.55,92.41 | IC16.16 64.45,28.59 64.45,14.94 63.5,13.98 v63.5,12.71 | IC8.16 122.24,28.59 v122.24,10.17 | 146.37,60.34 v146.69,60.66 | 146.37,60.34 146.37,50.18 145.73,49.54 145.73,36.52 146.05,36.21 146.05,24.14 145.73,23.82 145.73,10.17 IC6.1 | v147.32,79.39 148.27,78.44 148.27,68.27 146.37,66.37 146.37,60.34 | v31.11,67 30.8,66.69 30.8,25.09 32.7,23.19 32.7,19.06 RN2.7
ADATA14  (via drill 0.35)
  Top 0.152: 100.01,68.59 IC28.10 | 100.01,68.59 v70.8,68.59 40.96,68.59 IC37.12 | 100.01,68.59 107,68.59 107.31,68.91 117.47,68.91 117.79,68.59 v129.22,68.59 136.53,68.59 136.84,68.91 141.6,68.91 141.92,68.59 158.43,68.59 IC21.10 | IC14.10 101.92,15.25 v127.32,15.25 139.7,15.25 140.02,15.57 143.83,15.57 144.15,15.25 158.43,15.25 IC6.10
  Bottom 0.152: IC37.12 38.42,71.13 38.42,94.63 IC36.12 | IC30.14 70.8,81.93 v70.8,68.59 | IC23.14 129.22,81.93 v129.22,68.59 | RN2.8 24.77,12.39 24.77,12.08 29.53,7.32 69.53,7.32 | 69.53,7.32 69.53,28.59 IC16.14 | IC8.14 127.32,28.59 v127.32,15.25 127.32,6.36 70.48,6.36 69.53,7.32 | IC21.10 156.53,66.69 156.53,40.34 158.75,38.11 158.75,18.11 IC6.10
ADATA15  (via drill 0.35)
  Top 0.152: RN2.9 21.59,17.79 60.64,17.79 61.91,19.06 72.07,19.06 v72.39,18.74 | v74.3,79.39 73.98,79.07 v42.86,79.07 | v133.99,72.72 134.3,73.04 159.7,73.04 IC21.9 v165.1,67.64 | IC14.9 103.82,17.79 v128.91,17.79 | IC28.9 105.09,69.23 v106.68,69.23 | IC6.9 160.34,19.06 v133.99,19.06 | v75.56,73.36 76.2,72.72 99.38,72.72 99.69,72.4 103.19,72.4 v103.5,72.72 | IC16.12 77.15,26.05 v106.36,26.05
  Bottom 0.152: v72.39,18.74 72.71,19.06 72.71,28.59 IC16.12 | IC37.11 42.86,71.13 v42.86,79.07 42.86,94.63 IC36.11 | IC30.12 74.3,82.25 v74.3,79.39 75.88,77.8 75.88,73.67 v75.56,73.36 | v133.99,72.72 134.3,73.04 134.3,81.93 IC23.12 | 132.08,20.97 132.4,21.28 132.4,28.59 IC8.12 | 132.08,20.97 v128.91,17.79 | v106.68,69.23 106.36,68.91 v106.36,26.05 106.36,20.33 IC14.9 | 132.08,20.97 v133.99,19.06 | v165.1,67.64 165.1,19.38 IC6.9 | v103.5,72.72 104.14,72.08 IC28.9
BUS-DIR  (via drill 0.35)
  Top 0.152: IC38.3 28.89,99.07 v19.68,99.07
  Bottom 0.152: IC37.1 18.1,63.51 18.1,74.31 | IC35.1 18.1,74.31 | 18.1,87.01 IC36.1 | 18.1,74.31 18.1,87.01 | v19.68,99.07 18.1,97.48 18.1,87.01
DATA0  (via drill 0.35)
  Top 0.152: X1.A19 6.03,64.78 6.99,64.78 7.3,65.1 v20.95,65.1
  Bottom 0.152: IC37.2 20.64,63.51 20.64,65.1 | 20.64,65.1 20.64,74.31 IC35.2 | 20.64,65.1 v20.95,65.1
DATA1  (via drill 0.35)
  Top 0.152: X1.A20 6.35,67.64 v23.5,67.64
  Bottom 0.152: IC37.3 23.18,63.51 23.18,67.64 | 23.18,67.64 23.18,74.31 IC35.3 | 23.18,67.64 v23.5,67.64
DATA2  (via drill 0.35)
  Top 0.152: X1.A21 6.03,69.86 6.99,69.86 7.3,70.18 16.83,70.18 18.41,71.77 v25.72,71.77
  Bottom 0.152: IC37.4 25.72,63.51 v25.72,71.77 25.72,74.31 IC35.4
DATA3
  Top 0.152: X1.A22 6.35,72.72 12.38,72.72 13.34,73.67 27.62,73.67 IC35.5
  Bottom 0.152: IC37.5 28.26,63.51 28.26,74.31 IC35.5
DATA4
  Top 0.152: X1.A23 6.35,75.26 16.83,75.26 18.41,76.85 30.16,76.85 IC35.6
  Bottom 0.152: IC37.6 31.75,67.96 30.8,68.91 30.8,73.04 31.75,73.99 IC35.6
DATA5  (via drill 0.35)
  Top 0.152: X1.A24 6.35,77.8 13.97,77.8 15.24,79.07 v33.34,79.07
  Bottom 0.152: IC37.7 33.34,63.51 33.34,71.45 34.29,72.4 IC35.7 34.29,78.12 v33.34,79.07
DATA6  (via drill 0.35)
  Top 0.152: v13.34,61.92 14.29,60.97 35.24,60.97 IC37.8
  Bottom 0.152: IC37.8 35.88,63.51 35.88,74.31 IC35.8 | X1.A25 6.35,77.8 6.35,63.51 7.3,62.56 13.34,62.56 v13.34,61.92
DATA7  (via drill 0.35)
  Top 0.152: v13.34,72.72 13.97,73.36 32.07,73.36 33.34,74.62 33.34,76.85 37.78,76.85 IC35.9
  Bottom 0.152: IC37.9 40.32,63.51 40.32,74.31 IC35.9 | X1.A26 6.35,82.88 13.34,82.88 v13.34,72.72
DATA8
  Top 0.152: IC36.2 19.05,85.42 6.35,85.42 X1.A27
DATA9
  Top 0.152: IC36.3 22.54,89.55 16.19,89.55 14.61,87.96 6.35,87.96 X1.A28
DATA10  (via drill 0.35)
  Top 0.152: v26.04,90.5 25.08,91.45 11.43,91.45 10.48,90.5 6.35,90.5 X1.A29
  Bottom 0.152: IC36.4 26.04,88.59 v26.04,90.5
DATA11
  Top 0.152: IC36.5 26.67,85.42 19.68,85.42 19.05,84.78 12.38,84.78 10.48,82.88 4.76,82.88 3.81,83.83 3.81,91.77 X1.A30
DATA12  (via drill 0.35)
  Top 0.152: v27.94,33.67 26.99,32.71 12.38,32.71 10.48,34.62 7.3,34.62 6.35,33.67 6.35,23.19 X1.B3
  Bottom 0.152: IC36.6 30.8,87.01 30.8,73.67 30.16,73.04 30.16,39.06 27.94,36.84 v27.94,33.67
DATA13  (via drill 0.35)
  Top 0.152: v33.02,98.12 32.7,98.44 v5.08,98.44
  Bottom 0.152: IC36.7 33.02,89.23 v33.02,98.12 | v5.08,98.44 3.17,96.53 3.17,28.59 4.76,27 7.62,27 X1.B4
DATA14  (via drill 0.35)
  Top 0.152: IC36.8 34.92,89.86 15.88,89.86 14.61,88.59 v13.65,88.59
  Bottom 0.152: v13.65,88.59 13.97,88.28 13.97,46.37 12.38,44.78 12.38,31.44 10.48,29.54 7.62,29.54 X1.B5
DATA15  (via drill 0.35)
  Top 0.152: IC36.9 33.34,93.99 11.43,93.99 10.48,93.04 v4.45,93.04
  Bottom 0.152: v4.45,93.04 3.49,92.09 3.49,33.35 4.76,32.08 7.62,32.08 X1.B6
GND  (via drill 0.35)
  Top 0.152: JP2.39 JP2.40 | JP2.2 JP2.1 JP1.39 | JP1.39 163.83,63.83 IC21.8 160.97,64.15 137.48,64.15 IC2.7 | JP1.39 JP1.40 | JP1.2 JP1.1 | v40.96,67.64 C32.2 | X1.C32 X1.B32 X1.A32 4.13,97.8 4.13,99.71 15.56,99.71 C34.2 25.4,105.74 25.4,102.25 | 25.4,102.25 IC38.1 | IC36.10 46.35,92.41 57.78,92.41 C28.2 C9.2 C21.2 | C26.2 49.53,107.01 41.91,107.01 IC38.8 | 25.4,102.25 33.97,102.25 IC38.5 | C8.2 C18.2 | C13.2 117.47,40.34 140.34,40.34 C29.2 | C10.2 C17.2 | C11.2 C30.2 | X1.A1 X1.B1 X1.C1 13.34,21.28 v20.95,21.28 | C36.2 C38.2 | C1.2 C22.2 | C24.2 C16.2 C15.2 | IC19.8 157.8,105.42 141.29,105.42 C25.2
  Bottom 0.152: IC8.10 136.84,22.87 136.84,33.67 IC1.7 135.89,36.21 136.84,37.16 136.84,46.37 IC7.10 137.79,49.23 137.79,60.66 IC2.7 134.94,63.51 134.94,74.31 | IC23.10 134.94,74.31 | 134.94,74.31 134.94,87.01 IC17.7 136.84,88.91 136.84,99.71 IC22.10 | 171.45,9.22 172.72,9.22 JP2.39 | 171.45,9.22 IC6.8 161.61,10.17 161.61,22.87 | 171.45,9.22 PWR.K | 161.61,22.87 IC5.8 | 161.61,33.67 161.61,22.87 | IC4.8 161.61,33.67 | 161.61,33.67 161.61,46.37 IC3.8 161.61,48.27 161.61,63.51 | 161.61,76.21 IC20.8 | 161.61,87.01 161.61,76.21 | IC18.8 161.61,87.01 | 161.61,87.01 161.61,99.71 IC19.8 162.56,101.93 JP1.1 | 161.61,63.51 IC21.8 | 161.61,76.21 161.61,63.51 | IC31.7 40.96,22.87 40.96,33.67 | IC33.8 40.96,33.67 | 40.96,46.37 IC32.8 | 40.96,33.67 40.96,46.37 | 40.96,61.61 IC37.10 | 40.96,46.37 40.96,61.61 | 40.96,61.61 v40.96,67.64 40.96,74.31 IC35.10 40.96,76.21 40.96,88.91 | C3.2 14.29,67.32 14.29,79.39 | C6.2 14.29,79.39 | 14.29,79.39 14.29,92.09 C2.2 9.84,93.04 8.89,93.99 8.89,95.58 X1.C32 | 38.1,103.2 40.64,105.74 IC38.8 | 38.1,103.2 IC38.5 | 38.1,103.2 IC38.7 40.64,89.23 40.96,88.91 | 40.96,88.91 IC36.10 | C23.2 IC25.8 102.87,99.39 102.87,93.36 104.14,92.09 IC26.8 103.19,87.01 103.19,76.21 IC27.8 105.09,74.31 105.09,63.51 IC28.8 103.19,61.61 103.19,46.37 | C18.2 IC16.10 76.2,19.38 C20.2 | 102.87,14.62 IC14.8 | 102.87,14.62 101.92,15.57 101.92,20.97 IC13.8 103.82,22.87 103.82,34.3 IC12.8 103.19,35.57 103.19,46.37 | 102.87,14.62 106.68,18.43 106.68,24.46 C8.2 108.27,27.95 108.27,51.45 C15.2 112.08,55.26 112.08,62.88 | 103.19,46.37 IC11.8 | C17.2 112.08,62.88 | C19.2 112.08,77.48 112.08,62.88 | C31.2 141.92,15.25 141.92,26.05 C37.2 141.92,27.95 141.92,40.65
  Bottom 0.152: 141.92,51.45 C35.2 | 141.92,40.65 141.92,51.45 | C29.2 141.92,40.65 | 141.92,66.69 C10.2 | 141.92,51.45 141.92,66.69 | 141.92,79.39 C33.2 | 141.92,66.69 141.92,79.39 | 141.92,92.09 C27.2 | 141.92,79.39 141.92,92.09 | C25.2 141.92,104.79 141.92,92.09 | 83.5,79.39 83.5,68.59 C14.2 83.5,66.69 83.5,50.18 | C11.2 83.5,79.39 | 83.5,92.09 C9.2 | 83.5,79.39 83.5,92.09 | C12.2 83.19,105.11 83.19,103.83 83.5,103.52 83.5,92.09 | C5.2 19.37,51.45 19.37,49.54 19.68,49.23 19.68,40.34 C4.2 19.37,38.75 19.37,26.68 22.86,23.19 | C24.2 49.53,51.13 C36.2 | 22.86,23.19 23.81,24.14 23.81,26.05 C38.2 | 22.86,23.19 v20.95,21.28 | IC29.10 78.42,99.71 78.42,88.91 IC24.7 77.47,87.01 76.52,86.05 76.52,76.21 IC30.10 76.52,74.31 76.52,66.37 77.47,65.42 IC10.7 78.42,61.61 78.42,48.27 | IC9.7 76.52,35.57 76.52,46.37 IC15.10 78.42,48.27 | 78.42,48.27 81.92,51.77 | 81.92,51.77 C16.2 | C1.2 83.5,40.65 83.5,50.18 | 81.92,51.77 83.5,50.18
IA-0  (via drill 0.35)
  Top 0.152: IC15.11 79.06,53.35 v92.39,53.35 92.71,53.03 105.09,53.03 105.41,53.35 109.54,53.35 110.81,52.08 122.56,52.08 122.87,52.4 133.99,52.4 v134.3,52.72 | JP2.5 167.64,58.75 v137.16,58.75
  Bottom 0.152: v92.39,53.35 91.44,52.4 IC11.3 | v137.16,58.75 134.3,55.89 v134.3,52.72
IA-1  (via drill 0.35)
  Top 0.152: v73.34,51.77 73.66,51.45 87.63,51.45 v87.95,51.77 | JP2.7 173.99,52.4 173.99,57.48 171.13,57.48 167.96,60.66 155.89,60.66 154.94,59.7 119.7,59.7 v119.06,60.34 | v118.43,61.61 116.2,63.83 105.09,63.83 104.78,64.15 v87.95,64.15
  Bottom 0.152: IC15.13 73.34,53.99 v73.34,51.77 | IC11.2 88.9,50.81 v87.95,51.77 v87.95,64.15 | v119.06,60.34 118.43,60.97 v118.43,61.61
IA-2  (via drill 0.35)
  Top 0.152: 71.75,59.07 90.49,59.07 91.44,60.02 98.74,60.02 v100.01,58.75 | 71.75,59.07 v67.94,59.07 | JP2.9 165.1,56.21 165.1,58.43 137.79,58.43 137.48,58.11 133.03,58.11 131.76,59.38 117.47,59.38 116.2,60.66 73.34,60.66 71.75,59.07
  Bottom 0.152: IC15.15 67.94,55.57 v67.94,59.07 | v100.01,58.75 100.01,48.27 IC11.6
IA-3  (via drill 0.35)
  Top 0.152: v62.55,57.48 70.48,57.48 71.12,58.11 v101.28,58.11 102.23,57.16 158.12,57.16 158.43,57.48 163.51,57.48 163.51,55.26 JP2.11
  Bottom 0.152: IC15.17 62.55,55.26 v62.55,57.48 | v101.28,58.11 100.65,57.48 100.65,48.27 IC11.7
IA-4  (via drill 0.35)
  Top 0.152: v58.74,43.51 61.91,40.34 81.28,40.34 81.92,40.97 85.41,40.97 85.72,40.65 v92.39,40.65 v109.86,40.65 | JP2.13 173.99,42.24 173.99,34.62 164.78,34.62 163.19,33.03 v114.94,33.03
  Bottom 0.152: IC15.2 58.74,45.73 v58.74,43.51 | v92.39,40.65 91.44,39.7 IC12.3 | v114.94,33.03 109.86,38.11 v109.86,40.65
IA-5  (via drill 0.35)
  Top 0.152: v61.28,39.06 61.91,38.43 v87,38.43 120.33,38.43 121.6,37.16 136.53,37.16 v137.16,36.52
  Bottom 0.152: IC15.4 61.28,46.37 v61.28,39.06 | v87,38.43 88.9,36.52 IC12.2 | JP2.15 173.99,39.7 173.99,5.41 171.77,3.19 137.16,3.19 v137.16,36.52
IA-6  (via drill 0.35)
  Top 0.152: v71.12,36.21 81.6,36.21 81.92,35.89 85.41,35.89 85.72,36.21 97.47,36.21 IC12.6 | JP2.17 171.13,36.84 v144.78,36.84 | v143.51,32.4 106.36,32.4 106.05,32.08 v99.69,32.08
  Bottom 0.152: IC15.6 71.12,43.51 v71.12,36.21 | v144.78,36.84 143.51,35.57 v143.51,32.4 | v99.69,32.08 99.06,32.71 IC12.6
IA-7  (via drill 0.35)
  Top 0.152: v75.56,39.06 75.88,38.75 86.36,38.75 86.68,39.06 v100.97,39.06 | JP2.19 172.4,36.21 137.79,36.21 137.48,35.89 136.84,35.89 136.21,36.52 118.43,36.52 117.79,35.89 105.09,35.89 104.78,36.21 103.19,36.21 IC12.7
  Bottom 0.152: IC15.8 73.34,46.37 73.34,45.41 74.93,43.83 75.88,43.83 75.88,39.38 v75.56,39.06 | v100.97,39.06 101.6,38.43 IC12.7
IA-8  (via drill 0.35)
  Top 0.152: JP2.21 171.13,31.76 133.35,31.76 133.03,32.08 106.68,32.08 106.05,31.44 83.82,31.44 v83.5,31.76
  Bottom 0.152: 83.5,29.54 83.82,29.54 83.82,25.41 86.68,22.55 86.68,20.65 87,20.33 90.17,20.33 IC13.3 | 83.5,29.54 IC16.11 | 83.5,29.54 v83.5,31.76
IA-9  (via drill 0.35)
  Top 0.152: JP2.23 172.09,31.44 133.03,31.44 132.72,31.76 120.65,31.76 v119.38,30.49 | v119.06,25.09 118.75,25.41 75.25,25.41 IC16.13
  Bottom 0.152: IC16.13 73.98,32.4 84.14,32.4 84.14,30.81 83.82,30.49 83.82,30.17 84.14,29.86 84.14,25.73 87.63,22.24 IC13.2 | v119.38,30.49 119.06,30.17 v119.06,25.09
IA-10  (via drill 0.35)
  Top 0.152: IC16.15 64.45,27.95 57.78,27.95 57.47,28.27 57.47,32.4 98.42,32.4 v98.74,32.08 | JP2.25 169.86,31.13 v132.4,31.13 | v129.22,19.06 128.91,18.74 120.02,18.74 119.7,19.06 100.65,19.06 100.33,18.74 99.06,18.74 v98.42,19.38
  Bottom 0.152: v98.74,32.08 98.74,24.46 97.79,23.51 IC13.6 97.79,20.01 v98.42,19.38 | v132.4,31.13 129.22,31.13 v129.22,19.06
IA-11  (via drill 0.35)
  Top 0.152: v62.23,18.43 63.18,17.47 82.23,17.47 84.45,15.25 v98.74,15.25 99.38,14.62 139.7,14.62 140.34,15.25 141.29,15.25 141.6,14.94 162.88,14.94 v163.83,15.89
  Bottom 0.152: IC16.17 62.23,28.27 v62.23,18.43 | v98.74,15.25 99.38,15.89 99.38,18.43 100.33,19.38 IC13.7 | JP2.27 163.83,16.84 v163.83,15.89
IA-12  (via drill 0.35)
  Top 0.152: v56.2,8.59 83.5,8.59 84.45,7.63 88.58,7.63 IC14.3 | JP2.29 173.99,21.92 173.99,19.38 168.28,19.38 161.61,12.71 v92.08,12.71
  Bottom 0.152: IC16.2 56.2,21.6 v56.2,8.59 | v92.08,12.71 90.17,10.81 IC14.3
IA-13  (via drill 0.35)
  Top 0.152: IC16.4 63.5,19.38 v84.77,19.38 85.41,20.01 99.06,20.01 99.06,19.38 99.38,19.06 100.01,19.06 100.33,19.38 120.02,19.38 120.33,19.06 123.51,19.06 124.14,19.7 171.77,19.7 JP2.31
  Bottom 0.152: v84.77,19.38 86.68,17.47 86.68,10.17 IC14.2
IA-14  (via drill 0.35)
  Top 0.152: v66.04,7.95 66.67,7.32 95.89,7.32 | IC14.6 95.89,7.32 | JP2.33 173.99,16.84 173.99,11.76 167.32,11.76 162.88,7.32 95.89,7.32
  Bottom 0.152: v66.04,7.95 IC16.6
IA-15  (via drill 0.35)
  Top 0.152: JP2.35 169.23,12.08 142.56,12.08 141.29,10.81 104.14,10.81 103.5,11.44 v102.23,11.44
  Bottom 0.152: IC16.8 71.75,21.28 71.75,15.89 80.01,7.63 100.33,7.63 IC14.7 100.33,9.54 v102.23,11.44
IC-0  (via drill 0.35)
  Top 0.152: v80.01,99.71 82.23,101.93 85.41,101.93 85.72,102.25 89.85,102.25 IC25.3 | JP1.5 167.64,112.09 134.94,112.09 v134.3,111.45 | v131.76,105.42 131.13,104.79 92.39,104.79 v92.08,105.11
  Bottom 0.152: IC29.11 81.28,104.47 81.28,98.12 80.96,97.8 80.01,97.8 v80.01,99.71 | v134.3,111.45 131.76,108.91 v131.76,105.42 | v92.08,105.11 91.44,104.47 IC25.3
IC-1  (via drill 0.35)
  Top 0.152: v73.66,110.5 v86.36,110.5 90.17,110.5 90.49,110.19 101.28,110.19 v103.5,112.41 | JP1.7 171.13,106.06 v142.88,106.06
  Bottom 0.152: IC29.13 73.66,109.55 v73.66,110.5 | v86.36,110.5 87.95,108.91 87.95,101.61 IC25.2 | v142.88,106.06 136.53,112.41 v103.5,112.41
IC-2
  Bottom 0.152: IC29.15 72.07,113.04 100.01,113.04 | 100.01,113.04 100.01,106.06 99.06,105.11 IC25.6 | JP1.9 173.99,103.2 173.99,112.41 173.04,113.36 100.01,113.36 100.01,113.04
IC-3  (via drill 0.35)
  Top 0.152: IC29.17 66.67,103.83 81.92,103.83 82.23,104.15 88.27,104.15 88.9,103.52 v100.97,103.52 | JP1.11 171.45,98.12 171.45,93.04 173.04,93.04 173.99,92.09 173.99,90.5 168.59,90.5 166.69,92.41 141.6,92.41 141.29,92.09 123.51,92.09 122.24,93.36 v120.02,93.36
  Bottom 0.152: IC25.7 101.6,102.88 v100.97,103.52 102.55,105.11 102.55,109.87 116.2,109.87 116.52,109.55 116.52,107.64 119.38,104.79 119.38,93.99 v120.02,93.36
IC-4  (via drill 0.35)
  Top 0.152: v57.15,90.5 58.1,89.55 63.18,89.55 63.5,89.86 81.92,89.86 82.23,89.55 89.85,89.55 IC26.3 93.34,89.86 105.09,89.86 105.41,89.55 117.16,89.55 117.79,90.18 125.09,90.18 126.36,91.45 141.29,91.45 141.6,91.14 v167,91.14
  Bottom 0.152: v57.15,90.5 IC29.2 | v167,91.14 JP1.13
IC-5  (via drill 0.35)
  Top 0.152: v65.72,92.41 66.04,92.09 v87,92.09 105.73,92.09 v106.05,92.41 | JP1.15 173.99,95.58 173.99,100.66 164.78,100.66 162.24,98.12 v111.76,98.12
  Bottom 0.152: IC29.4 65.72,97.17 v65.72,92.41 | v87,92.09 88.9,90.18 IC26.2 | v106.05,92.41 v111.76,98.12
IC-6  (via drill 0.35)
  Top 0.152: JP1.17 171.77,92.72 142.56,92.72 141.29,93.99 105.41,93.99 104.78,93.36 99.69,93.36 v99.38,93.67
  Bottom 0.152: IC29.6 73.98,107.33 73.98,109.55 77.15,112.72 97.79,112.72 97.79,94.63 99.06,93.36 | IC26.6 99.06,93.36 | 99.06,93.36 v99.38,93.67
IC-7  (via drill 0.35)
  Top 0.152: v73.34,86.37 73.98,85.74 v100.65,85.74 | JP1.19 172.09,89.86 141.6,89.86 141.29,89.55 140.34,89.55 140.02,89.86 118.11,89.86 117.47,89.23 105.09,89.23 104.78,89.55 103.19,89.55 IC26.7
  Bottom 0.152: IC29.8 73.34,99.71 v73.34,86.37 | v100.65,85.74 101.6,86.69 IC26.7
IC-8  (via drill 0.35)
  Top 0.152: IC30.11 78.11,82.25 v84.45,82.25 | v84.77,76.85 89.85,76.85 IC27.3 | JP1.21 167.32,81.29 151.76,81.29 150.81,82.25 150.81,84.47 v111.44,84.47 | v106.36,79.39 105.41,78.44 v93.34,78.44
  Bottom 0.152: v84.45,82.25 84.77,81.93 v84.77,76.85 | v106.36,79.39 v111.44,84.47 | v93.34,78.44 91.44,76.53 IC27.3
IC-9  (via drill 0.35)
  Top 0.152: v73.03,78.44 73.34,78.75 v88.27,78.75 | JP1.23 166.05,77.48 v143.19,77.48 | v142.88,72.4 142.56,72.08 117.47,72.08 117.16,72.4 113.67,72.4 113.35,72.08 v89.22,72.08
  Bottom 0.152: IC30.13 73.03,82.25 v73.03,78.44 | v88.27,78.75 88.9,78.12 IC27.2 88.9,72.4 v89.22,72.08 | v143.19,77.48 142.88,77.16 v142.88,72.4
IC-10  (via drill 0.35)
  Top 0.152: IC30.15 68.9,81.29 81.6,81.29 81.92,81.61 85.41,81.61 85.72,81.29 v98.11,81.29 | JP1.25 164.47,73.36 100.33,73.36 v100.01,73.04
  Bottom 0.152: v98.11,81.29 97.79,80.97 97.79,69.23 98.42,68.59 100.01,68.59 v100.01,73.04 100.01,74.31 IC27.6
IC-11  (via drill 0.35)
  Top 0.152: IC30.17 63.82,84.47 v100.01,84.47 | v163.83,96.53 162.88,97.48 108.27,97.48 104.78,93.99 v100.65,93.99
  Bottom 0.152: IC27.7 100.65,76.21 100.65,83.83 v100.01,84.47 100.01,93.36 v100.65,93.99 | JP1.27 163.83,87.96 v163.83,96.53
IC-12  (via drill 0.35)
  Top 0.152: v57.47,60.02 59.37,58.11 65.41,58.11 65.72,57.8 70.17,57.8 70.8,58.43 91.44,58.43 v91.76,58.75
  Bottom 0.152: IC30.2 57.47,74.94 v57.47,60.02 | v91.76,58.75 91.44,59.07 IC28.3
IC-13  (via drill 0.35)
  Top 0.152: v63.5,66.37 v87,66.37 87.31,66.05 117.16,66.05 117.47,65.73 122.56,65.73 122.87,66.05 141.29,66.05 141.92,65.42 164.15,65.42 JP1.31
  Bottom 0.152: IC30.4 63.18,74.31 63.18,66.69 v63.5,66.37 | v87,66.37 88.9,64.47 IC28.2
IC-14  (via drill 0.35)
  Top 0.152: v68.26,67 68.58,66.69 86.36,66.69 86.68,67 v101.6,67 106.05,67 107.63,68.59 117.16,68.59 117.79,67.96 129.54,67.96 129.86,68.27 136.84,68.27 137.16,68.59 141.29,68.59 141.6,68.27 149.86,68.27 v152.08,66.05 | JP1.33 166.05,64.78 v153.35,64.78
  Bottom 0.152: IC30.6 66.04,73.99 66.04,69.23 v68.26,67 | v101.6,67 99.06,64.47 IC28.6 | v152.08,66.05 v153.35,64.78
IC-15  (via drill 0.35)
  Top 0.152: v73.34,59.7 73.98,60.34 99.38,60.34 v99.69,60.02 100.65,59.07 130.49,59.07 131.76,57.8 v164.47,57.8
  Bottom 0.152: IC30.8 73.34,74.31 v73.34,59.7 | v99.69,60.02 101.6,61.92 IC28.7 | JP1.35 164.47,68.91 v164.47,57.8
N$1  (via drill 0.35)
  Top 0.152: IC31.8 44.45,32.08 v45.4,32.08 | v45.4,82.88 43.81,84.47 23.18,84.47 IC35.19
  Bottom 0.152: IC35.19 20.64,83.83 20.64,94.63 IC36.19 | v45.4,82.88 v45.4,32.08
N$2
  Bottom 0.152: IC26.4 93.03,88.91 93.03,107.33 IC25.13
N$3
  Bottom 0.152: IC26.5 95.25,89.23 95.25,107.01 IC25.12
N$4
  Bottom 0.152: IC27.4 94.93,76.21 94.93,94.63 IC26.13
N$5
  Bottom 0.152: IC27.5 97.47,76.21 97.47,93.04 96.52,93.99 IC26.12
N$6
  Bottom 0.152: IC28.4 93.03,63.51 93.03,77.16 93.98,78.12 IC27.13
N$7
  Bottom 0.152: IC28.5 95.57,63.51 95.57,81.93 IC27.12
N$8
  Top 0.152: IC24.8 79.06,97.17 97.47,97.17 IC26.11
  Bottom 0.152: IC25.11 98.11,107.33 98.11,96.53 IC26.11
N$9  (via drill 0.35)
  Top 0.152: v71.44,97.8 93.03,97.8 93.66,98.44 95.57,98.44 v95.89,98.12
  Bottom 0.152: IC24.3 71.44,92.09 v71.44,97.8 | v95.89,98.12 96.52,98.75 IC25.5
N$10
  Bottom 0.152: IC4.4 151.45,35.57 151.45,53.99 IC3.13
N$11
  Bottom 0.152: IC4.5 153.99,35.57 153.99,53.99 IC3.12
N$12
  Bottom 0.152: IC5.4 153.35,22.87 153.35,41.29 IC4.13
N$13
  Bottom 0.152: IC5.5 155.89,22.87 155.89,41.29 IC4.12
N$14
  Bottom 0.152: IC6.4 151.45,10.17 151.45,28.59 IC5.13
N$15
  Bottom 0.152: IC6.5 153.67,10.49 153.67,28.27 IC5.12
N$16
  Top 0.152: IC1.8 137.48,43.83 155.89,43.83 IC4.11
  Bottom 0.152: IC3.11 158.43,53.99 158.43,43.19 IC4.11
N$17  (via drill 0.35)
  Top 0.152: v126.68,49.86 127.32,49.23 140.34,49.23 140.65,48.91 153.35,48.91 IC3.5
  Bottom 0.152: IC1.3 126.68,35.57 v126.68,49.86
N$18  (via drill 0.35)
  Top 0.152: v134.62,43.19 135.57,44.14 163.19,44.14 163.83,44.78 163.83,45.73 153.99,45.73 IC3.4
  Bottom 0.152: IC1.6 134.62,35.89 v134.62,43.19
N$19
  Bottom 0.152: IC31.3 30.16,20.33 25.4,20.33 25.4,46.05 IC32.1
N$20  (via drill 0.35)
  Top 0.152: v115.89,57.8 v125.73,57.8
  Bottom 0.152: IC7.1 115.57,49.86 IC7.19 115.57,57.48 v115.89,57.8 | v125.73,57.8 IC2.3
N$21  (via drill 0.35)
  Top 0.152: v116.84,58.43 v130.18,58.43
  Bottom 0.152: IC8.1 113.98,22.87 113.98,27.95 IC8.19 115.57,39.7 116.84,40.97 v116.84,58.43 | IC2.6 132.08,61.29 132.08,60.34 v130.18,58.43
N$22  (via drill 0.35)
  Top 0.152: v156.53,38.43 v129.22,38.43
  Bottom 0.152: IC6.11 156.53,17.79 156.53,28.59 | IC5.11 156.53,28.59 | IC1.11 129.22,41.29 v129.22,38.43 | 156.53,28.59 v156.53,38.43
N$23  (via drill 0.35)
  Top 0.152: v76.2,96.53 77.15,97.48 93.66,97.48 v93.98,97.8
  Bottom 0.152: IC24.6 76.2,89.23 v76.2,96.53 | IC25.4 v93.98,97.8
N$24  (via drill 0.35)
  Top 0.152: IC31.6 37.47,23.82 v28.57,23.82
  Bottom 0.152: v28.57,23.82 25.72,26.68 25.72,53.99 IC32.15
N$25  (via drill 0.35)
  Top 0.152: v78.42,85.1 78.11,84.78 v55.88,84.78
  Bottom 0.152: IC10.8 78.42,71.13 v78.42,85.1 | v55.88,84.78 54.61,86.05 IC29.1 54.61,105.74 IC29.19
N$26  (via drill 0.35)
  Top 0.152: v56.83,73.04 v68.26,73.04
  Bottom 0.152: IC30.19 57.15,77.8 IC30.1 v56.83,73.04 | IC10.11 68.26,71.77 v68.26,73.04
N$27  (via drill 0.35)
  Top 0.152: IC24.11 71.44,93.99 v97.47,93.99
  Bottom 0.152: IC28.11 98.11,71.13 98.11,80.34 99.06,81.29 IC27.11 98.11,83.83 98.11,93.36 v97.47,93.99
N$28
  Bottom 0.152: IC12.4 93.03,35.57 93.03,53.99 IC11.13
N$29
  Bottom 0.152: IC12.5 95.57,35.57 95.57,53.99 IC11.12
N$30
  Bottom 0.152: IC13.4 93.98,23.19 93.98,32.4 94.93,33.35 94.93,41.29 IC12.13
N$31
  Bottom 0.152: IC13.5 96.52,23.19 96.52,32.4 97.47,33.35 97.47,41.29 IC12.12
N$32
  Bottom 0.152: IC14.4 92.71,14.62 91.76,15.57 91.76,28.59 IC13.13
N$33
  Bottom 0.152: IC14.5 94.3,10.17 94.3,28.59 IC13.12
N$34
  Top 0.152: IC9.8 79.06,43.83 97.47,43.83 IC12.11
  Bottom 0.152: IC11.11 98.11,53.99 98.11,43.19 IC12.11
N$35  (via drill 0.35)
  Top 0.152: v68.9,44.46 94.61,44.46 96.52,46.37 IC11.5
  Bottom 0.152: IC9.3 68.9,36.21 v68.9,44.46
N$36  (via drill 0.35)
  Top 0.152: v81.28,46.05 81.6,45.73 92.39,45.73 IC11.4
  Bottom 0.152: IC9.6 76.52,33.03 81.28,33.03 v81.28,46.05
N$37  (via drill 0.35)
  Top 0.152: IC31.11 32.7,27.95 31.11,27.95 30.16,28.9 30.16,39.38 v22.54,39.38
  Bottom 0.152: v22.54,39.38 22.86,39.7 22.86,51.45 25.08,53.67 25.08,57.48 22.54,60.02 22.54,69.23 IC37.19
N$38  (via drill 0.35)
  Top 0.152: v65.72,50.18 64.45,48.91 56.2,48.91 IC15.1
  Bottom 0.152: IC15.1 55.88,48.59 55.88,53.67 IC15.19 | IC10.3 66.99,62.24 66.99,56.84 65.72,55.57 v65.72,50.18
N$39  (via drill 0.35)
  Top 0.152: v71.44,51.77 70.48,50.81 v53.02,50.81
  Bottom 0.152: IC16.1 54.61,23.19 54.61,28.27 IC16.19 53.34,32.08 53.34,50.49 v53.02,50.81 | IC10.6 75.88,61.61 75.88,46.05 75.56,45.73 73.66,45.73 73.66,49.54 v71.44,51.77
N$40  (via drill 0.35)
  Top 0.152: v70.17,36.52 70.48,36.84 81.6,36.84 82.23,36.21 85.09,36.21 85.41,36.52 v98.11,36.52
  Bottom 0.152: IC14.11 96.84,17.79 96.84,28.59 IC13.11 97.79,36.21 v98.11,36.52 | IC9.11 70.17,41.92 v70.17,36.52
N$41
  Bottom 0.152: IC31.9 35.56,33.35 35.56,98.12 IC38.4
N$42
  Top 0.152: IC31.12 33.34,31.13 35.24,31.13 IC31.10
  Bottom 0.152: IC38.11 34.61,109.87 44.77,109.87 44.77,22.55 42.55,20.33 37.78,20.33 37.78,28.59 IC31.10
N$43  (via drill 0.35)
  Top 0.152: v36.2,17.16 33.66,14.62 23.5,14.62 22.54,13.67 22.54,4.14 11.43,4.14 J1.3
  Bottom 0.152: IC32.5 35.24,46.37 35.24,20.97 36.2,20.01 v36.2,17.16
N$44
  Top 0.152: R1.1 155.89,5.09 173.04,5.09 PWR.A
N$46  (via drill 0.35)
  Top 0.152: IC32.6 34.29,44.78 32.07,44.78 30.16,42.88 30.16,40.65 21.91,40.65 19.68,42.88 v16.19,42.88
  Bottom 0.152: v16.19,42.88 13.97,40.65 13.97,4.14 J1.5
N$47  (via drill 0.35)
  Top 0.152: IC32.7 36.51,44.46 34.29,44.46 32.7,42.88 32.7,40.02 21.27,40.02 20.64,40.65 v19.05,40.65
  Bottom 0.152: v19.05,40.65 17.46,39.06 17.46,5.09 J1.7
N$48  (via drill 0.35)
  Top 0.152: IC32.11 33.66,58.11 v23.5,58.11
  Bottom 0.152: v23.5,58.11 20.32,61.29 20.32,100.34 12.38,108.28 10.16,108.28 J2.3
N$49  (via drill 0.35)
  Top 0.152: IC32.10 35.56,58.75 v24.77,58.75
  Bottom 0.152: v24.77,58.75 22.86,60.66 22.86,99.39 J2.5